# Altium schematic sheet accessories.SchDoc
size A4
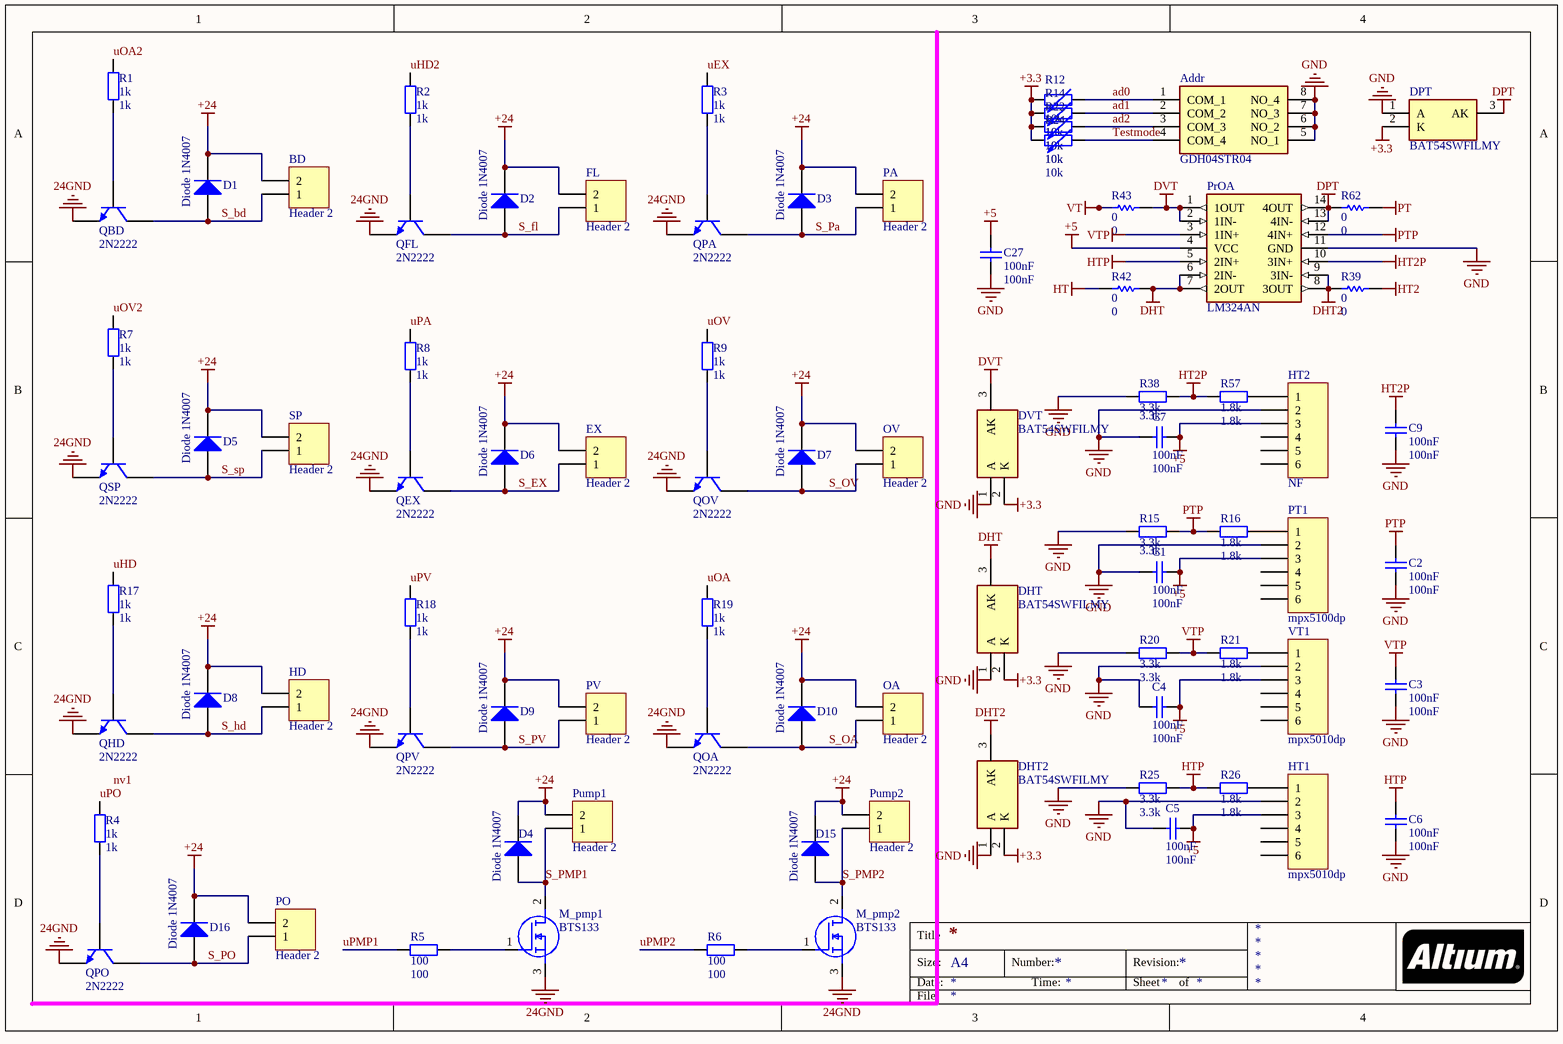
[diagram p0: accessories.SchDoc]

## Parts
Addr  GDH04STR04  [GDH04STR04]
BD  Header 2  [PHOENIX2-Right]
C1  100nF  [0805]
C2  100nF  [0805]
C3  100nF  [0805]
C4  100nF  [0805]
C5  100nF  [0805]
C6  100nF  [0805]
C7  100nF  [0805]
C9  100nF  [0805]
C27  100nF  [0805]
D1  Diode 1N4007  [DO-41]
D2  Diode 1N4007  [DO-41]
D3  Diode 1N4007  [DO-41]
D4  Diode 1N4007  [DO-41]
D5  Diode 1N4007  [DO-41]
D6  Diode 1N4007  [DO-41]
D7  Diode 1N4007  [DO-41]
D8  Diode 1N4007  [DO-41]
D9  Diode 1N4007  [DO-41]
D10  Diode 1N4007  [DO-41]
D15  Diode 1N4007  [DO-41]
D16  Diode 1N4007  [DO-41]
DHT  BAT54SWFILMY  [psm712]
DHT2  BAT54SWFILMY  [psm712]
DPT  BAT54SWFILMY  [psm712]
DVT  BAT54SWFILMY  [psm712]
EX  Header 2  [PHOENIX2-Right]
FL  Header 2  [PHOENIX2-Right]
HD  Header 2  [PHOENIX2-Right]
HT1  mpx5010dp  [mpx-dp]
HT2  NF  [mpx-dp]
M_pmp1  BTS133  [IPB026N06NATMA1]
M_pmp2  BTS133  [IPB026N06NATMA1]
OA  Header 2  [PHOENIX2-Right]
OV  Header 2  [PHOENIX2-Right]
PA  Header 2  [PHOENIX2-Right]
PO  Header 2  [PHOENIX2-right]
PrOA  LM324AN  [DIP254P762X432-14]
PT1  mpx5100dp  [mpx-dp]
Pump1  Header 2  [PHOENIX2-Right]
Pump2  Header 2  [PHOENIX2-Right]
PV  Header 2  [PHOENIX2-Right]
QBD  2N2222  [2n2222]
QEX  2N2222  [2n2222]
QFL  2N2222  [2n2222]
QHD  2N2222  [2n2222]
QOA  2N2222  [2n2222]
QOV  2N2222  [2n2222]
QPA  2N2222  [2n2222]
QPO  2N2222  [2n2222]
QPV  2N2222  [2n2222]
QSP  2N2222  [2n2222]
R1  1k  [0805]
R2  1k  [0805]
R3  1k  [0805]
R4  1k  [0805]
R5  100  [0805]
R6  100  [0805]
R7  1k  [0805]
R8  1k  [0805]
R9  1k  [0805]
R12  10k  [0805]
R14  10k  [0805]
R15  3.3k  [0805]
R16  1.8k  [0805]
R17  1k  [0805]
R18  1k  [0805]
R19  1k  [0805]
R20  3.3k  [0805]
R21  1.8k  [0805]
R22  10k  [0805]
R24  10k  [0805]
R25  3.3k  [0805]
R26  1.8k  [0805]
R38  3.3k  [0805]
R39  0  [0805]
R42  0  [0805]
R43  0  [0805]
R57  1.8k  [0805]
R62  0  [0805]
SP  Header 2  [PHOENIX2-Right]
VT1  mpx5010dp  [mpx-dp]

## Nets
24GND: M_pmp1.3(S) M_pmp2.3(S) QBD.1(E) QEX.1(E) QFL.1(E) QHD.1(E) QOA.1(E) QOV.1(E) QPA.1(E) QPO.1(E) QPV.1(E) QSP.1(E)
+3.3: DHT.2(K) DHT2.2(K) DPT.2(K) DVT.2(K) R12.2 R14.2 R22.2 R24.2
+5: C1.1 C4.1 C5.1 C7.1 C27.2 HT1.3 HT2.3 PrOA.4(VCC) PT1.3 VT1.3
+24: BD.2 D1.2(K) D2.2(K) D3.2(K) D4.2(K) D5.2(K) D6.2(K) D7.2(K) D8.2(K) D9.2(K) D10.2(K) D15.2(K) D16.2(K) EX.2 FL.2 HD.2 OA.2 OV.2 PA.2 PO.2 Pump1.2 Pump2.2 PV.2 SP.2
DHT: DHT.3(AK) PrOA.6(2IN-) PrOA.7(2OUT) R42.1
DHT2: DHT2.3(AK) PrOA.8(3OUT) PrOA.9(3IN-) R39.1
DPT: DPT.3(AK) PrOA.13(4IN-) PrOA.14(4OUT) R62.1
DVT: DVT.3(AK) PrOA.1(1OUT) PrOA.2(1IN-) R43.2
GND: Addr.5(NO_1) Addr.6(NO_2) Addr.7(NO_3) Addr.8(NO_4) C1.2 C2.2 C3.2 C4.2 C5.2 C6.2 C7.2 C9.2 C27.1 DHT.1(A) DHT2.1(A) DPT.1(A) DVT.1(A) HT1.2 HT2.2 PrOA.11(GND) PT1.2 R15.1 R20.1 R25.1 R38.1 VT1.2
HT: R42.2
HT2: R39.2
HT2P: C9.1 PrOA.10(3IN+) R38.2 R57.1
HTP: C6.1 PrOA.5(2IN+) R25.2 R26.1
PT: R62.2
PTP: C2.1 PrOA.12(4IN+) R15.2 R16.1
VT: R43.1
VTP: C3.1 PrOA.3(1IN+) R20.2 R21.1
ad0: Addr.1(COM_1) R12.1
ad1: Addr.2(COM_2) R14.1
ad2: Addr.3(COM_3) R22.1
S_bd: BD.1 D1.1(A) QBD.3(C)
S_EX: D6.1(A) EX.1 QEX.3(C)
S_fl: D2.1(A) FL.1 QFL.3(C)
S_hd: D8.1(A) HD.1 QHD.3(C)
S_OA: D10.1(A) OA.1 QOA.3(C)
S_OV: D7.1(A) OV.1 QOV.3(C)
S_Pa: D3.1(A) PA.1 QPA.3(C)
S_PMP1: D4.1(A) M_pmp1.2(D) Pump1.1
S_PMP2: D15.1(A) M_pmp2.2(D) Pump2.1
S_PO: D16.1(A) PO.1 QPO.3(C)
S_PV: D9.1(A) PV.1 QPV.3(C)
S_sp: D5.1(A) QSP.3(C) SP.1
Testmode: Addr.4(COM_4) R24.1
uEX: R3.1
uHD: R17.1
uHD2: R2.1
uOA: R19.1
uOA2: R1.1
uOV: R9.1
uOV2: R7.1
uPA: R8.1
uPMP1: R5.1
uPMP2: R6.1
uPO: R4.1
uPV: R18.1
NetHT1_1: HT1.1 R26.2
NetHT2_1: HT2.1 R57.2
NetM_pmp1_1: M_pmp1.1(G) R5.2
NetM_pmp2_1: M_pmp2.1(G) R6.2
NetPT1_1: PT1.1 R16.2
NetQBD_2: QBD.2(B) R1.2
NetQEX_2: QEX.2(B) R8.2
NetQFL_2: QFL.2(B) R2.2
NetQHD_2: QHD.2(B) R17.2
NetQOA_2: QOA.2(B) R19.2
NetQOV_2: QOV.2(B) R9.2
NetQPA_2: QPA.2(B) R3.2
NetQPO_2: QPO.2(B) R4.2
NetQPV_2: QPV.2(B) R18.2
NetQSP_2: QSP.2(B) R7.2
NetR21_2: R21.2 VT1.1

Not connected (* = marked no-connect by the designer): HT1 4 5 6; HT2 4 5 6; PT1 4 5 6; VT1 4 5 6

## Notes on the sheet
- Labels drawn without touching a wire or pin: nv1
- Title
- Size:
- Date:
- A4
- Number:
- Time:
- Revision:
- Sheet
- of
- File:

## Library data of the parts
Addr = GDH04STR04: Switch; Manufacturer_Name: TE Connectivity; Datasheet Link: https://www.te.com/commerce/DocumentDelivery/DDEController?Action=showdoc&DocId=Customer+Drawing%7F1571983%7FC6%7Fpdf%7FEnglish%7FENG_CD_1571983_C6.pdf%7F1571983-5; Height: 2.31mm; Manufacturer_Part_Number: GDH04STR04; Mouser Part Number: 506-GDH04STR04; Mouser Price/Stock: https://www.mouser.co.uk/ProductDetail/TE-Connectivity-Alcoswitch/GDH04STR04?qs=k5V78Jg%2Feq61xymfueD9KA%3D%3D; Arrow Part Number: GDH04STR04; Arrow Price/Stock: https://www.arrow.com/en/products/gdh04str04/te-connectivity?region=nac
BD EX FL HD OA OV PA PO Pump1 Pump2 PV SP = Header 2: Header, 2-Pin; LatestRevisionDate: 17-Jul-2002; LatestRevisionNote: Re-released for DXP Platform.; Publisher: Altium Limited
C1-C7 C9 = Cap: Capacitor; Published: 8-Jun-2000; LatestRevisionDate: 17-Jul-2002; LatestRevisionNote: Re-released for DXP Platform.; PackageReference: RAD-0.3; Publisher: Altium Limited; PackageDescription: Radial Cap, Thru-Hole; 2 Leads; 0.3 in Pin Spacing; Value: 100nF
C27 = Cap: Capacitor; Manufacturer: Generic Components; Class: Passive; Published: 08/06/2000; Publisher: Altium Hobart Technology Centre; SubClass: Capacitor; Value: 100nF
D1-D10 D15 D16 = Diode 1N4007: 1 Amp General Purpose Rectifier; Published: 8-Jun-2000; LatestRevisionDate: 17-Jul-2002; LatestRevisionNote: Re-released for DXP Platform.; DatasheetVersion: 1998; PackageVersion: Aug-1999; PackageReference: DO-41; Publisher: Altium Limited; PackageDescription: Diode, Axial; Body 5.2 x 2.7 mm (LxDia. max), Lead Dia. 0.86 mm (max); Code_JEDEC: DO-204-AL; ComponentLink1Description: Manufacturer Link; ComponentLink1URL: http://www.fairchildsemi.com/; ComponentLink2Description: Datasheet; ComponentLink2URL: http://www.fairchildsemi.com/ds/1N%2F1N4001.pdf
DHT DHT2 DPT DVT = BAT54SWFILMY: Schottky Diode; Manufacturer_Name: STMicroelectronics; Datasheet Link: https://www.st.com/resource/en/datasheet/cd00001322.pdf; Height: 1.1mm; Manufacturer_Part_Number: BAT54SWFILMY; Mouser Part Number: 511-BAT54SWFILMY; Mouser Price/Stock: https://www.mouser.co.uk/ProductDetail/STMicroelectronics/BAT54SWFILMY?qs=j%252B1pi9TdxUbxN4fraErVag%3D%3D; Arrow Part Number: BAT54SWFILMY; Arrow Price/Stock: https://www.arrow.com/en/products/bat54swfilmy/stmicroelectronics?region=europe
HT1 HT2 PT1 VT1 = Header 6: Header, 6-Pin; LatestRevisionDate: 17-Jul-2002; LatestRevisionNote: Re-released for DXP Platform.; Publisher: Altium Limited
M_pmp1 M_pmp2 = IPB026N06NATMA1: MOSFET (N-Channel); Manufacturer_Name: Infineon; Datasheet Link: https://www.infineon.com/dgdl/IPB026N06N_Rev2.0.pdf?folderId=db3a304313b8b5a60113cee8763b02d7&fileId=db3a3043372d5cc8013754c7b2a74f7c; Height: 4.82mm; Manufacturer_Part_Number: IPB026N06NATMA1; Mouser Part Number: 726-IPB026N06NATMA1; Mouser Price/Stock: https://www.mouser.co.uk/ProductDetail/Infineon-Technologies/IPB026N06NATMA1?qs=4MqXaUMeF56mbQMXMhITXA%3D%3D; Arrow Part Number: IPB026N06NATMA1; Arrow Price/Stock: https://www.arrow.com/en/products/ipb026n06natma1/infineon-technologies-ag
PrOA = LM324AN: Integrated Circuit; Manufacturer_Name: Texas Instruments; Datasheet Link: http://www.ti.com/lit/ds/symlink/lm324a.pdf; Height: 5.08mm; Manufacturer_Part_Number: LM324AN; Mouser Part Number: 595-LM324AN; Mouser Price/Stock: https://www.mouser.com/Search/Refine.aspx?Keyword=595-LM324AN; RS Part Number: 0527732; RS Price/Stock: http://uk.rs-online.com/web/p/products/0527732
QBD QEX QFL QHD QOA QOV QPA QPO QPV QSP = 2N3904: NPN General Purpose Amplifier; Published: 8-Jun-2000; LatestRevisionDate: 15-Jan-2003; LatestRevisionNote: PCB Footprint 'BCY-W3/D4.7' replaced; DatasheetVersion: 1997; PackageVersion: Sep-1998; PackageReference: TO-92A; Publisher: Altium Limited; PackageDescription: TO, Flat Index; 3 In-Line, Axial Leads; Body Dia. 4.5mm; Leads 0.51 x 0.48 mm (max); ComponentLink1Description: Manufacturer Link; ComponentLink1URL: http://www.fairchildsemi.com/; ComponentLink2Description: Datasheet; ComponentLink2URL: http://www.fairchildsemi.com/ds/2N%2F2N3904.pdf
R1-R9 R15-R21 R25 R26 R38 R57 = Res2: Resistor; Published: 8-Jun-2000; LatestRevisionDate: 17-Jul-2002; LatestRevisionNote: Re-released for DXP Platform.; PackageReference: AXIAL-0.4; Publisher: Altium Limited; PackageDescription: Axial Device, Thru-Hole; 2 Leads; 0.4 in Pin Spacing
  R1-R4 R7-R9 R17-R19: Value: 1k
  R5 R6: Value: 100
  R15 R20 R25 R38: Value: 3.3k
  R16 R21 R26 R57: Value: 1.8k
R12 R14 R22 R24 = Res Adj2: Variable Resistor; Set Position: 0.5; Published: 8-Jun-2000; LatestRevisionDate: 17-Jul-2002; LatestRevisionNote: Re-released for DXP Platform.; PackageReference: AXIAL-0.6; Publisher: Altium Limited; PackageDescription: Axial Device, Thru-Hole; 2 Leads; 0.6 in Pin Spacing; Value: 10k
R39 R42 R43 R62 = Res1: Resistor; Published: 8-Jun-2000; LatestRevisionDate: 17-Jul-2002; LatestRevisionNote: Re-released for DXP Platform.; PackageReference: AXIAL-0.3; Publisher: Altium Limited; Value: 0